# Altium schematic sheet Magway.SchDoc
size A2; SheetNumber: 1; SheetTotal: 1
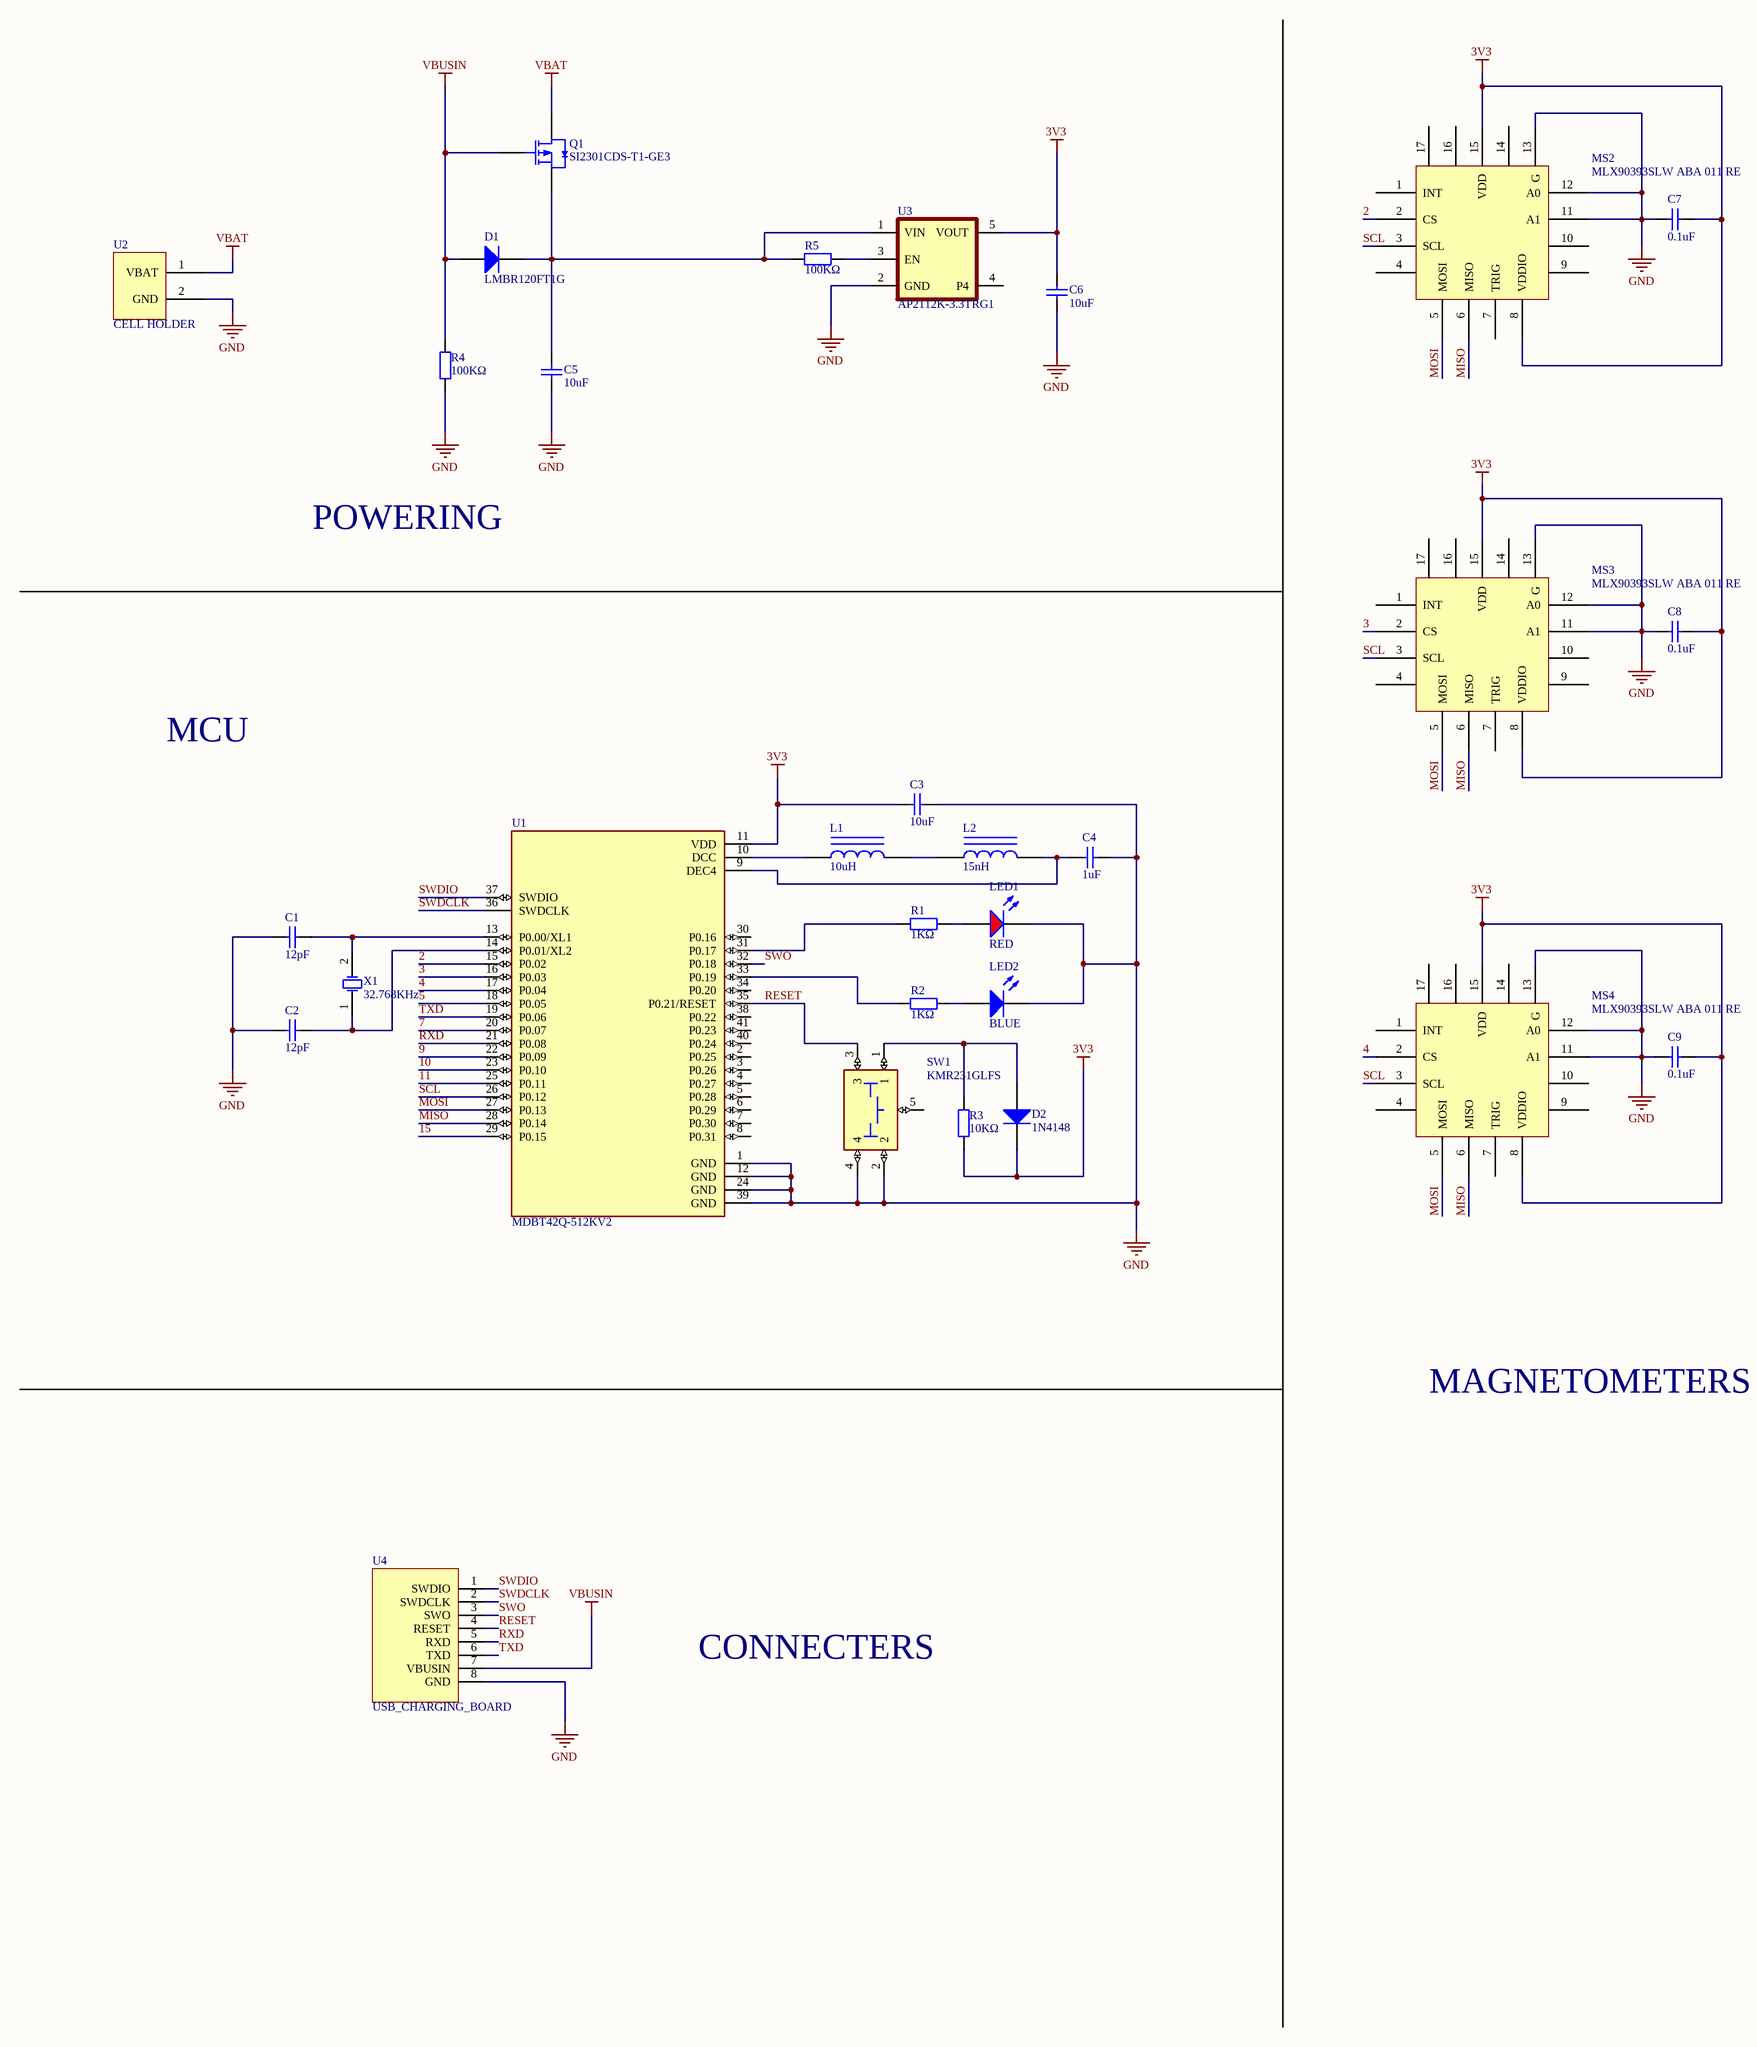
[diagram p0: Magway.SchDoc]

## Parts
C1  12pF  [0402_C]
C2  12pF  [0402_C]
C3  10uF  [0402_C]
C4  1uF  [0402_C]
C5  10uF  [0402_C]
C6  10uF  [0402_C]
C7  0.1uF  [0402_C]
C8  0.1uF  [0402_C]
C9  0.1uF  [0402_C]
D1  LMBR120FT1G  [SOD-123]
D2  1N4148  [SOD-323F]
L1  10uH  [0402_L]
L2  15nH  [0402_L]
LED1  RED  [0603_LED_S1]
LED2  BLUE  [0603_LED_S1]
MS2  MLX90393SLW ABA 011 RE  [VQFN-16_EP_3.0x3.0xo.5P]
MS3  MLX90393SLW ABA 011 RE  [VQFN-16_EP_3.0x3.0xo.5P]
MS4  MLX90393SLW ABA 011 RE  [VQFN-16_EP_3.0x3.0xo.5P]
Q1  SI2301CDS-T1-GE3  [SOT-23(SOT-23-3)]
R1  1KΩ  [0402_R]
R2  1KΩ  [0402_R]
R3  10KΩ  [0402_R]
R4  100KΩ  [0402_R]
R5  100KΩ  [0402_R]
SW1  KMR231GLFS  [KMR231GLFS]
U1  MDBT42Q-512KV2  [SMD_10.0X16.0]
U2  CELL HOLDER  [BAT_MX 1.25-WI-2P]
U3  AP2112K-3.3TRG1  [SOT95P285X140-5N]
U4  USB_CHARGING_BOARD  [FPC0.5 2H-WS-8P]
X1  32.768KHz  [SMD-3215_2P FC - 135]

## Nets
3V3: C3.1 C6.2 C7.2 C8.2 C9.2 D2.2(K) MS2.8(VDDIO) MS2.15(VDD) MS3.8(VDDIO) MS3.15(VDD) MS4.8(VDDIO) MS4.15(VDD) R3.1 U1.11(VDD) U3.5(VOUT)
GND: C1.1 C2.1 C3.2 C4.2 C5.1 C6.1 C7.1 C8.1 C9.1 LED1.K LED2.K MS2.11(A1) MS2.12(A0) MS2.13(G) MS3.11(A1) MS3.12(A0) MS3.13(G) MS4.11(A1) MS4.12(A0) MS4.13(G) R4.1 SW1.2 SW1.4 U1.1(GND) U1.12(GND) U1.24(GND) U1.39(GND) U2.2(GND) U3.2(GND) U4.8(GND)
VBAT: Q1.3(D) U2.1(VBAT)
VBUSIN: D1.1(A) Q1.1(G) R4.2 U4.7(VBUSIN)
2: MS2.2(CS) U1.15(P0.02)
3: MS3.2(CS) U1.16(P0.03)
4: MS4.2(CS) U1.17(P0.04)
5: U1.18(P0.05)
7: U1.20(P0.07)
9: U1.22(P0.09)
10: U1.23(P0.10)
11: U1.25(P0.11)
15: U1.29(P0.15)
MISO: MS2.6(MISO) MS3.6(MISO) MS4.6(MISO) U1.28(P0.14)
MOSI: MS2.5(MOSI) MS3.5(MOSI) MS4.5(MOSI) U1.27(P0.13)
RESET: SW1.3 U1.35(P0.21/RESET) U4.4(RESET)
RXD: U1.21(P0.08) U4.5(RXD)
SCL: MS2.3(SCL) MS3.3(SCL) MS4.3(SCL) U1.26(P0.12)
SWDCLK: U1.36(SWDCLK) U4.2(SWDCLK)
SWDIO: U1.37(SWDIO) U4.1(SWDIO)
SWO: U1.32(P0.18) U4.3(SWO)
TXD: U1.19(P0.06) U4.6(TXD)
NetC1_2: C1.2 U1.13(P0.00/XL1) X1.2(OSC2)
NetC2_2: C2.2 U1.14(P0.01/XL2) X1.1(OSC1)
NetC4_1: C4.1 L2.2 U1.9(DEC4)
NetC5_2: C5.2 D1.2(K) Q1.2(S) R5.2 U3.1(VIN)
NetD2_1: D2.1(A) R3.2 SW1.1
NetL1_1: L1.1 U1.10(DCC)
NetL1_2: L1.2 L2.1
NetLED1_A: LED1.A R1.2
NetLED2_A: LED2.A R2.2
NetR1_1: R1.1 U1.31(P0.17)
NetR2_1: R2.1 U1.33(P0.19)
NetR5_1: R5.1 U3.3(EN)

Not connected (* = marked no-connect by the designer): MS2 1(INT) 4 7(TRIG) 9 10 14 16 17; MS3 1(INT) 4 7(TRIG) 9 10 14 16 17; MS4 1(INT) 4 7(TRIG) 9 10 14 16 17; SW1 5; U1 2(P0.25) 3(P0.26) 4(P0.27) 5(P0.28) 6(P0.29) 7(P0.30) 8(P0.31) 30(P0.16) 34(P0.20) 38(P0.22) 40(P0.24) 41(P0.23); U3 4(P4)

## Notes on the sheet
- POWERING
- MCU
- MAGNETOMETERS
- CONNECTERS

## Library data of the parts
C1 C2 = CAP_12pF: capacitance
C3-C6 = CAP_10uF: capacitance; ComponentLink1Description: 供应商链接; ComponentLink1URL: http://www.szlcsc.com/product/details_16532.html; Package: 0805; Supplier: LC; SuppliersPartNumber: C15850
C7-C9 = CAP_1uF: capacitance; ComponentLink1Description: 供应商链接; ComponentLink1URL: http://www.szlcsc.com/product/details_16531.html; Package: 0603; Supplier: LC; SuppliersPartNumber: C15849
D1 = DIO_5: schottky diode; ComponentLink1Description: 供应商链接; ComponentLink1URL: http://www.szlcsc.com/product/details_9093.html; Package: SOD-123; Supplier: LC; SuppliersPartNumber: C8598
D2 = DIO_4: diode; ComponentLink1Description: 供应商链接; ComponentLink1URL: http://www.szlcsc.com/product/details_2485.html; Package: SOD-323; Supplier: LC; SuppliersPartNumber: C2128
L1 = IND_10uH: inductance; ComponentLink1Description: 供应商链接; ComponentLink1URL: http://www.szlcsc.com/product/details_1398.html; Package: 0805; Supplier: LC; SuppliersPartNumber: C1046
L2 = IND_15nH: inductance; ComponentLink1Description: 供应商链接; ComponentLink1URL: http://www.szlcsc.com/product/details_1398.html; Package: 0805; Supplier: LC; SuppliersPartNumber: C1046
LED1 = LED_RED: LED; ComponentLink1Description: 供应商链接; ComponentLink1URL: http://www.szlcsc.com/product/details_2659.html; Package: 0603; Supplier: LC; SuppliersPartNumber: C2286
LED2 = LED_BLUE: LED; ComponentLink1Description: 供应商链接; ComponentLink1URL: http://www.szlcsc.com/product/details_73150.html; Package: 0603; Supplier: LC; SuppliersPartNumber: C72041
MS2-MS4 = MLX90393SLW ABA 011 RE: sensor
Q1 = MOS: field effect tube; ComponentLink1Description: 供应商链接; ComponentLink1URL: http://www.szlcsc.com/product/details_11030.html; Package: SOT-23(SOT-23-3); Supplier: LC; SuppliersPartNumber: C10487
R1-R3 = RES_1KΩ: resistance; ComponentLink1Description: 供应商链接; ComponentLink1URL: http://www.szlcsc.com/product/details_26562.html; Package: 0603; Supplier: LC; SuppliersPartNumber: C25819
R4 R5 = RES_100KΩ: resistance; ComponentLink1Description: 供应商链接; ComponentLink1URL: http://www.szlcsc.com/product/details_26562.html; Package: 0603; Supplier: LC; SuppliersPartNumber: C25819
SW1 = KMR231GLFS: Tactile Switch SPST-NO Top Actuated Surface Mount
U1 = MDBT42Q-512KV2: RAYTAC  MDBT42Q-512KV2 Bluetooth Low Energy Module https://www.raytac.com/product/ins.php?index_id=31 https://www.snapeda.com/parts/MDBT42Q-512KV2/Raytac%20Corporation/view-part/?ref=search&t=MDBT42Q-512KV2
U2 = BAT: button cell battary holder BS-08-B2AA025
U3 = AP2112K: LDO_ low dropout linear regulator
X1 = ABS07-32.768KHZ-7-T: crystal; ComponentLink1Description: 供应商链接; ComponentLink1URL: http://www.szlcsc.com/product/details_33310.html; Package: SMD-3215_2P; Supplier: LC; SuppliersPartNumber: C32346